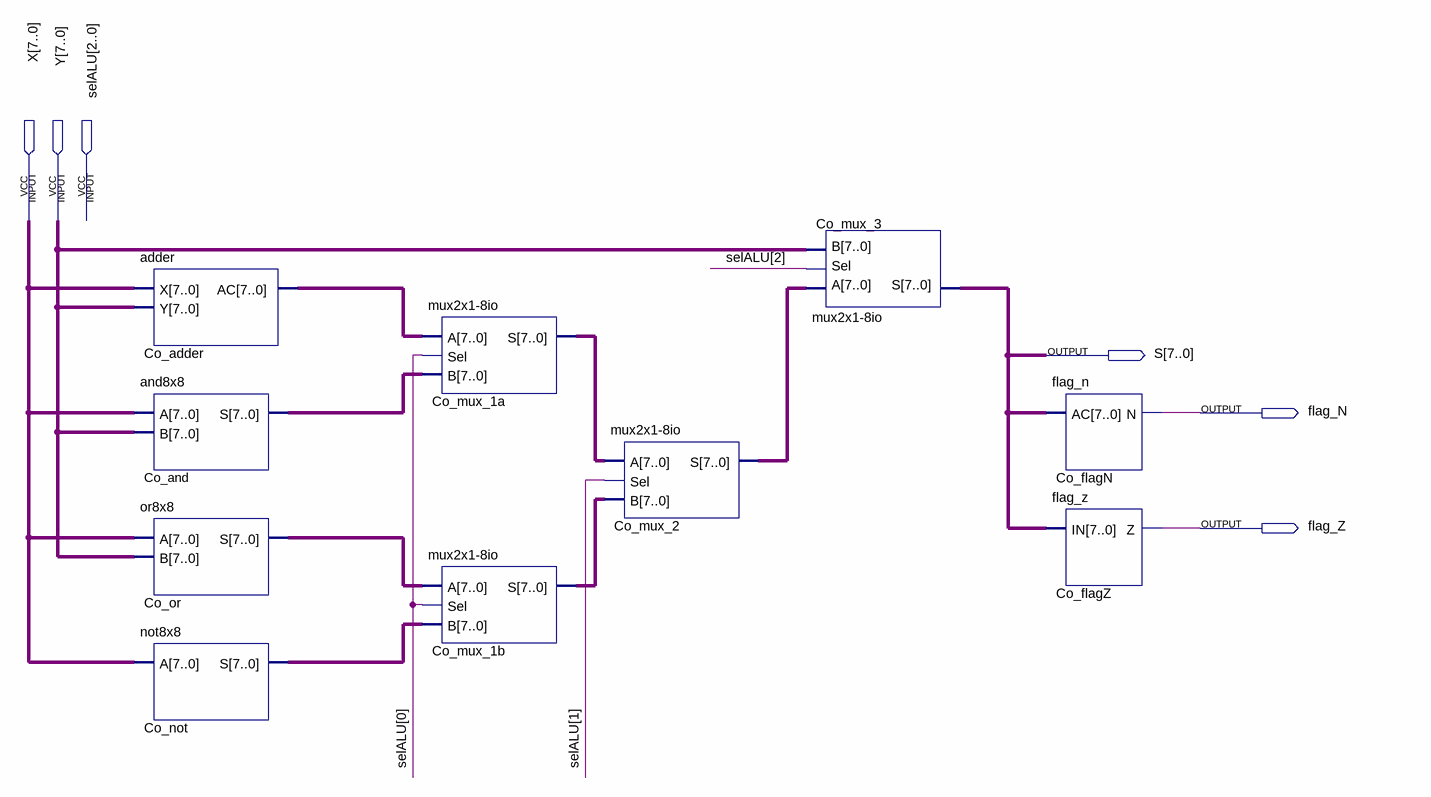
[diagram p0: schematic sheet]
// Quartus schematic alu.bdf as structural Verilog: 10 symbols, 6 pins
module alu (
  input  [7:0] X,
  input  [7:0] Y,
  input  [2:0] selALU,
  output [7:0] S,
  output flag_N,
  output flag_Z
);

  wire [7:0] Co_adder_ac, Co_and_s, Co_mux_1a_s, Co_mux_1b_s, Co_mux_2_s, Co_not_s, Co_or_s;

  adder Co_adder (.X(X), .Y(Y), .AC(Co_adder_ac));
  and8x8 Co_and (.A(X), .B(Y), .S(Co_and_s));
  or8x8 Co_or (.A(X), .B(Y), .S(Co_or_s));
  not8x8 Co_not (.A(X), .S(Co_not_s));
  \mux2x1-8io  Co_mux_1a (.A(Co_adder_ac), .Sel(selALU[0]), .B(Co_and_s), .S(Co_mux_1a_s));
  \mux2x1-8io  Co_mux_1b (.A(Co_or_s), .Sel(selALU[0]), .B(Co_not_s), .S(Co_mux_1b_s));
  \mux2x1-8io  Co_mux_2 (.A(Co_mux_1a_s), .Sel(selALU[1]), .B(Co_mux_1b_s), .S(Co_mux_2_s));
  \mux2x1-8io  Co_mux_3 (.A(Co_mux_2_s), .Sel(selALU[2]), .B(Y), .S(S));
  flag_n Co_flagN (.AC(S), .N(flag_N));
  flag_z Co_flagZ (.IN(S), .Z(flag_Z));
endmodule
